# Altium project LDO_RF.PrjPcb
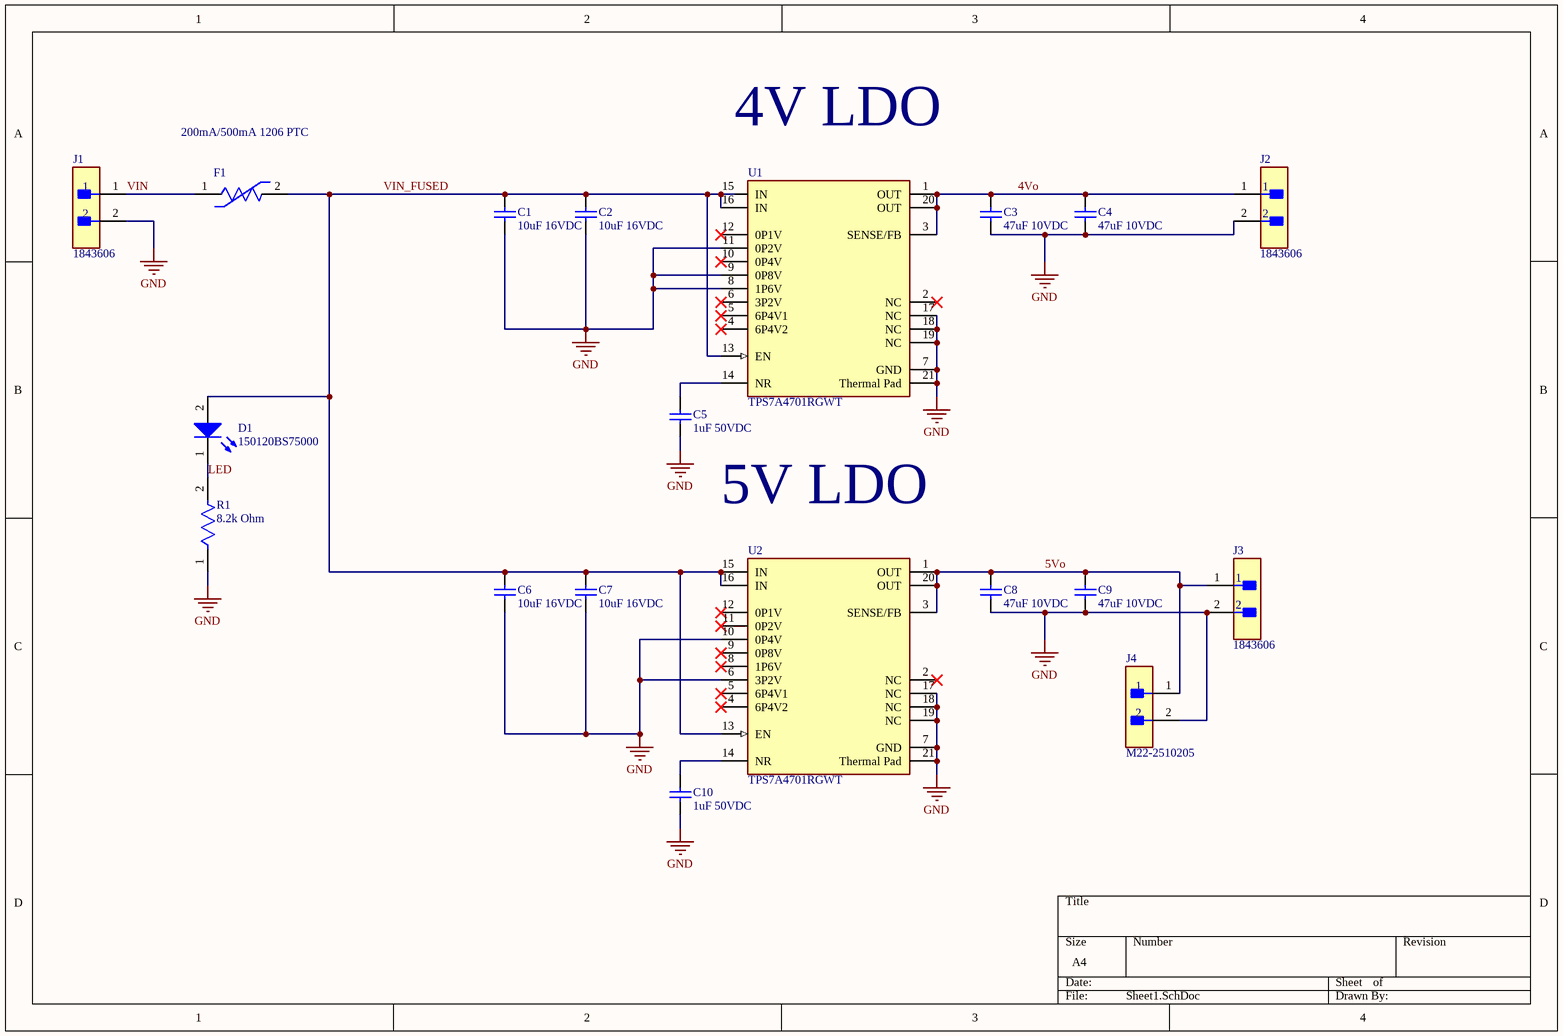
[diagram p0: Sheet1.SchDoc]
1 sheet, 19 parts. Net scope: global (net labels, ports and power ports of the same name join across sheets).
Board file: PCB1.PcbDoc

## Sheet Sheet1.SchDoc
size A4; SheetNumber: 1; SheetTotal: 1

### Parts
C1  10uF 16VDC  [CAPC1206(3216)170_M]
C2  10uF 16VDC  [CAPC1206(3216)170_M]
C3  47uF 10VDC  [CAPC1206(3216)170_M]
C4  47uF 10VDC  [CAPC1206(3216)170_M]
C5  1uF 50VDC  [CAPC1206(3216)170_M]
C6  10uF 16VDC  [CAPC1206(3216)170_M]
C7  10uF 16VDC  [CAPC1206(3216)170_M]
C8  47uF 10VDC  [CAPC1206(3216)170_M]
C9  47uF 10VDC  [CAPC1206(3216)170_M]
C10  1uF 50VDC  [CAPC1206(3216)170_M]
D1  150120BS75000  [WL-SMCW_1206_150120xx75000]
F1  200mA/500mA 1206 PTC  [FP-nanoSMD400LR-IPC_A]
J1  1843606  [FP-1843606-MFG]
J2  1843606  [FP-1843606-MFG]
J3  1843606  [FP-1843606-MFG]
J4  M22-2510205  [FP-M22-2510205-MFG]
R1  8.2k Ohm  [FP-RMCF1206-IPC_A]
U1  TPS7A4701RGWT  [FP-RGW0020A-MFG]
U2  TPS7A4701RGWT  [FP-RGW0020A-MFG]

### Nets
GND: C1.1 C2.1 C3.1 C4.1 C5.1 C6.1 C7.1 C8.1 C9.1 C10.1 J1.2 J2.2 J3.2 J4.2 R1.1 U1.7(GND) U1.8(1P6V) U1.9(0P8V) U1.11(0P2V) U1.17(NC) U1.18(NC) U1.19(NC) U1.21(Thermal_Pad) U2.6(3P2V) U2.7(GND) U2.10(0P4V) U2.17(NC) U2.18(NC) U2.19(NC) U2.21(Thermal_Pad)
4Vo: C3.2 C4.2 J2.1 U1.1(OUT) U1.3(SENSE/FB) U1.20(OUT)
5Vo: C8.2 C9.2 J3.1 J4.1 U2.1(OUT) U2.3(SENSE/FB) U2.20(OUT)
LED: D1.1(K) R1.2
VIN: F1.1 J1.1
VIN_FUSED: C1.2 C2.2 C6.2 C7.2 D1.2(A) F1.2 U1.13(EN) U1.15(IN) U1.16(IN) U2.13(EN) U2.15(IN) U2.16(IN)
NetC5_2: C5.2 U1.14(NR)
NetC10_2: C10.2 U2.14(NR)

Not connected (* = marked no-connect by the designer): U1 2(NC)* 4(6P4V2)* 5(6P4V1)* 6(3P2V)* 10(0P4V)* 12(0P1V)*; U2 2(NC)* 4(6P4V2)* 5(6P4V1)* 8(1P6V)* 9(0P8V)* 11(0P2V)* 12(0P1V)*

### Notes on the sheet
- 4V LDO
- 5V LDO

### Library data of the parts
C1 C2 C6 C7 = CMP-1037-03125-1: CL31B106KOHNNNE10uF 16VDC; Rated Voltage: 100 V; Value: 4.7nF; Tolerance: Â±2%; Case-Metric: 3216; Case-EIA: 1206; Max Thickness: 1.7 mm; Technology: SMT
C3 C4 C8 C9 = CMP-1037-03125-1: CL31A476MPHNNN 47uF 10V; Rated Voltage: 100 V; Value: 4.7nF; Tolerance: Â±2%; Case-Metric: 3216; Case-EIA: 1206; Max Thickness: 1.7 mm; Technology: SMT
C5 C10 = CMP-1037-03125-1: CC1206KKX7R7BB1051uF 50VDC; Rated Voltage: 100 V; Value: 4.7nF; Tolerance: Â±2%; Case-Metric: 3216; Case-EIA: 1206; Max Thickness: 1.7 mm; Technology: SMT
D1 = CMP-1426-00015-3: WL-SMCW SMT Mono-Color Chip LED Waterclear; Manufacturer Package Identifier: LED_1206; Dominant Wavelength: 470nm; Lens Style: Clear, Rectangular; Test Current: 20mA; Forward Voltage: 3.2V; Forward Current: 100mA; Peak Wavelength: 465nm; Max Reverse Voltage (DC): 5V; Viewing Angle: 140°; Color: Blue; Luminous Intensity: 145mcd; Max Operating Temperature: 85°C; Case Code (Imperial): 1206; Length: 3.2mm; Width: 1.6mm; Min Operating Temperature: -40°C; Height: 680µm; Case Code (Metric): 3216; Packaging: Tape and Reel; RoHS: Compliant; Case/Package: 1206; REACH SVHC: Unknown; Wavelength: 470nm; Mount: Surface Mount
F1 = CMP-08606-000072-1: PTC RESET FUSE 6V 4A 1206; RoHS Compliant: Yes
J1-J3 = CMP-00298-00064326-1: 1843606 Phoenix Contact 1843606 MCV 1, 5/ 2-G-3, 5 2 Way Terminal Block Header 8A 3.5mm; NexarPartId: 64326; Voltage: 300V; Voltage Rating (DC): 640mV; Number of Contacts: 2; Approvals: CSA, UL; Number of Levels: 1; Voltage Rating (AC): 160V; Connector Type: Plug; Gender: Male; Current Rating: 8A; Housing Material: Polybutylene; Flammability Rating: UL94 V-0; Number of Positions Per Level: 2; Weight: 113.398093g; Width: 7.25mm; Current: 8A; Depth: 7.25mm; Min Operating Temperature: -40°C; Contact Material: Tin; Pitch: 3.5mm; Ambient Temperature Range High: 100°C; Number of Rows: 1; Color: Green; Height: 8.4mm; REACH SVHC: No SVHC; Max Operating Temperature: 100°C; Number of Poles: 2; Number of Positions: 2; Material: PBT; Orientation: Straight; Mount: Through Hole; Max Current Rating: 8A; Contact Plating: Tin; RoHS: Compliant; Lead Free: Lead Free; Lead Pitch: 3.81mm; Termination: Solder; Voltage Rating: 160V; Length: 8.4mm; Housing Color: Green
J4 = CMP-15831-000005-1: CONN HEADER VERT 2POS 2MM; Manufacturer: Harwin; Conn Gender: Male; Current Rating: 2A; Number Of Contacts: 2; Conn Orientation: Vertical; Temperature Range Low: -40°C; Device Class L1: Connectors; ComponentLink2URL: https://cdn.harwin.com/pdfs/C018XX_M22_Series_Connectors.pdf; Temperature Range High: +105°C; Pitch: 2mm; Number Of Rows: 1; Temperature: -40°C to +105°C; Automotive: No; Device Class L3: unset; Octopart: https://octopart.com/m22-2510205-harwin-2538221; Mouser Description: Headers & Wire Housings 2 PIN SIL VERTICAL GOLD PIN HEADER; Height: 5.45mm; Category: Conn; Digikey Description: CONN HEADER VERT 2POS 2MM; Contact Material: Gold,Nickel; Lead Free: Yes; ComponentLink2Description: Datasheet; Manufacturer Part Number: M22-2510205; Device Class L2: Headers and Wire Housings; Package: 0; Footprint Url: https://cdn.harwin.com/pdfs/M22-251.pdf; RoHS: TRUE
R1 = CMP-26527-000539-1: 8.2k Ohm 1206; Resistance: 63.4kR; Tolerance: 1%; Max Power Dissipation: 250mW; Temperature Coefficient: 100ppm/°C; Case/Package: 1206; Min Operating Temperature: -55°C; Number of Terminations: 2; Series: RMCF; Height: 0.028inch; Max Operating Temperature: 155°C; Resistor Type: Thick Film; Length: 0.126inch; Features: Automotive AEC-Q200; Contact Plating: Tin; Width: 0.063inch; Radiation Hardening: No; Package Quantity: 10000; Mount: Surface Mount; Packaging: Tape and Reel; RoHS Compliant: Yes
U1 U2 = CMP-04917-000017-1: IC REG LINEAR POS ADJ 1A 20VQFN; Manufacturer: Texas Instruments; Output Type: AdjustableProgrammable; Dropout Voltage: 307mV; Number Of Outputs: 1; Nominal Supply Current: 0.58-6.1mA; Max Supply Voltage: 35V; Max Junction Temp: +125°C; Standoff Height: 0mm; Accuracy Percentage: 2.5%; Output Voltage: 1.4-34mV; Min Supply Voltage: 3V; Automotive: No; Output Current: 1A; ComponentLink2Description: Datasheet; Octopart: https://octopart.com/tps7a4701rgwt-texas+instruments-30261754; Height: 1mm; Category: IC; Temperature: -40°C to +125°C; Temperature Range High: +125°C; Device Class L1: Integrated Circuits (ICs); Temperature Range Low: -40°C; Device Class L3: Voltage Regulators - Linear; Manufacturer Part Number: TPS7A4701RGWT; Digikey Description: IC REG LINEAR POS ADJ 1A 20VQFN; Device Class L2: Power Management ICs; Lead Free: Yes; Package: RGW0020A; Mouser Description: LDO Voltage Regulators 36V 1A 4.17uVRMS RF LDO VTG Reg; ComponentLink2URL: http://www.ti.com/lit/ds/symlink/tps7a47.pdf; RoHS: TRUE